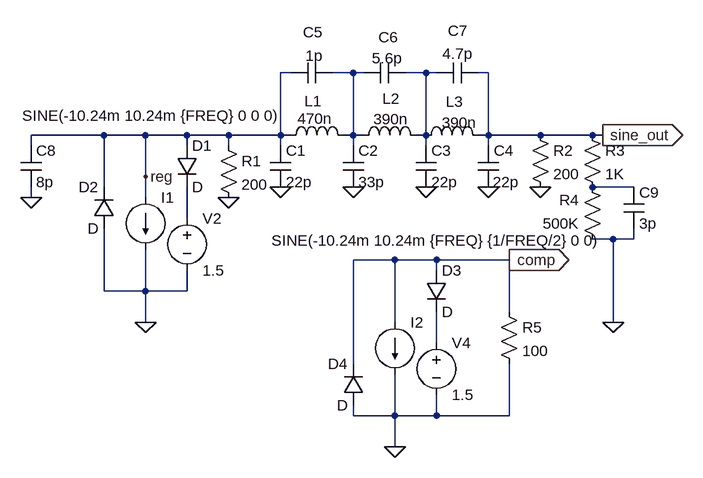
[diagram p0: schematic AD9850.asc]
AD9850.asc, the LTspice schematic file:
Version 4
SHEET 1 1172 680
WIRE 192 -16 176 -16
WIRE 288 -16 256 -16
WIRE 304 -16 288 -16
WIRE 400 -16 368 -16
WIRE 416 -16 400 -16
WIRE 496 -16 480 -16
WIRE -96 80 -208 80
WIRE -32 80 -96 80
WIRE 32 80 -32 80
WIRE 96 80 32 80
WIRE 176 80 176 -16
WIRE 176 80 96 80
WIRE 192 80 176 80
WIRE 288 80 288 -16
WIRE 288 80 272 80
WIRE 304 80 288 80
WIRE 400 80 400 -16
WIRE 400 80 384 80
WIRE 496 80 496 -16
WIRE 496 80 480 80
WIRE 576 80 496 80
WIRE 656 80 576 80
WIRE 672 80 656 80
WIRE -208 96 -208 80
WIRE 32 96 32 80
WIRE 96 96 96 80
WIRE 176 96 176 80
WIRE 288 96 288 80
WIRE 400 96 400 80
WIRE 496 96 496 80
WIRE -32 144 -32 80
WIRE -96 160 -96 80
WIRE 720 160 656 160
WIRE -208 176 -208 160
WIRE -32 176 -32 144
WIRE 32 208 32 160
WIRE 688 240 656 240
WIRE 720 240 720 224
WIRE 720 240 688 240
WIRE 352 272 288 272
WIRE 416 272 352 272
WIRE 528 272 416 272
WIRE 416 288 416 272
WIRE -96 320 -96 224
WIRE -32 320 -32 256
WIRE -32 320 -96 320
WIRE 32 320 32 288
WIRE 32 320 -32 320
WIRE 528 352 528 272
WIRE -32 368 -32 320
WIRE 352 368 352 272
WIRE 688 368 688 240
WIRE 416 400 416 352
WIRE 288 432 288 272
WIRE 288 512 288 496
WIRE 352 512 352 448
WIRE 352 512 288 512
WIRE 416 512 416 480
WIRE 416 512 352 512
WIRE 528 512 528 432
WIRE 528 512 416 512
WIRE 352 560 352 512
FLAG -32 368 0
FLAG 96 176 0
FLAG 176 160 0
FLAG 288 160 0
FLAG 400 160 0
FLAG 496 160 0
FLAG 576 160 0
FLAG 672 80 sine_out
IOPIN 672 80 Out
FLAG -208 176 0
FLAG 688 368 0
FLAG 352 560 0
FLAG 528 272 comp
IOPIN 528 272 Out
FLAG -32 144 reg
SYMBOL current -32 176 R0
WINDOW 3 -190 -126 Left 2
WINDOW 123 0 0 Left 0
WINDOW 39 24 28 Left 2
SYMATTR Value SINE(-10.24m 10.24m {FREQ} 0 0 0)
SYMATTR InstName I1
SYMBOL res 80 80 R0
SYMATTR InstName R1
SYMATTR Value 200
SYMBOL res 560 64 R0
SYMATTR InstName R2
SYMATTR Value 200
SYMBOL cap 160 96 R0
SYMATTR InstName C1
SYMATTR Value 22p
SYMBOL cap 272 96 R0
SYMATTR InstName C2
SYMATTR Value 33p
SYMBOL cap 384 96 R0
SYMATTR InstName C3
SYMATTR Value 22p
SYMBOL cap 480 96 R0
WINDOW 3 23 56 Left 2
SYMATTR Value 22p
SYMATTR InstName C4
SYMBOL ind 288 96 M270
WINDOW 0 53 62 VTop 2
WINDOW 3 57 59 VBottom 2
SYMATTR InstName L1
SYMATTR Value 470n
SYMBOL ind 400 96 M270
WINDOW 0 57 54 VTop 2
WINDOW 3 56 54 VBottom 2
SYMATTR InstName L2
SYMATTR Value 390n
SYMBOL ind 496 96 M270
WINDOW 0 52 52 VTop 2
WINDOW 3 51 45 VBottom 2
SYMATTR InstName L3
SYMATTR Value 390n
SYMBOL cap 256 -32 R90
WINDOW 0 -31 30 VBottom 2
WINDOW 3 -26 28 VTop 2
SYMATTR InstName C5
SYMATTR Value 1p
SYMBOL cap 368 -32 R90
WINDOW 0 -23 26 VBottom 2
WINDOW 3 -22 28 VTop 2
SYMATTR InstName C6
SYMATTR Value 5.6p
SYMBOL cap 480 -32 R90
WINDOW 0 -33 31 VBottom 2
WINDOW 3 -29 31 VTop 2
SYMATTR InstName C7
SYMATTR Value 4.7p
SYMBOL cap -224 96 R0
SYMATTR InstName C8
SYMATTR Value 8p
SYMBOL diode 16 96 R0
SYMATTR InstName D1
SYMBOL diode -80 224 R180
WINDOW 0 24 64 Left 2
WINDOW 3 24 0 Left 2
SYMATTR InstName D2
SYMBOL voltage 32 192 R0
WINDOW 123 0 0 Left 0
WINDOW 39 0 0 Left 0
SYMATTR InstName V2
SYMATTR Value 1.5
SYMBOL res 640 64 R0
SYMATTR InstName R3
SYMATTR Value 1K
SYMBOL res 672 256 R180
WINDOW 0 36 76 Left 2
WINDOW 3 36 40 Left 2
SYMATTR InstName R4
SYMATTR Value 500K
SYMBOL cap 704 160 R0
SYMATTR InstName C9
SYMATTR Value 3p
SYMBOL current 352 368 R0
WINDOW 3 -190 -126 Left 2
WINDOW 123 0 0 Left 0
WINDOW 39 24 28 Left 2
SYMATTR Value SINE(-10.24m 10.24m {FREQ} {1/FREQ/2} 0 0)
SYMATTR InstName I2
SYMBOL diode 400 288 R0
SYMATTR InstName D3
SYMBOL diode 304 496 R180
WINDOW 0 24 64 Left 2
WINDOW 3 24 0 Left 2
SYMATTR InstName D4
SYMBOL voltage 416 384 R0
WINDOW 123 0 0 Left 0
WINDOW 39 0 0 Left 0
SYMATTR InstName V4
SYMATTR Value 1.5
SYMBOL res 512 336 R0
SYMATTR InstName R5
SYMATTR Value 100

The netlist it stands for:
* AD9850.asc
I1 reg 0 SINE(-10.24m 10.24m {FREQ} 0 0 0)
R1 reg 0 200
R2 sine_out 0 200
C1 reg 0 22p
C2 N001 0 33p
C3 N002 0 22p
C4 sine_out 0 22p
L1 N001 reg 470n
L2 N002 N001 390n
L3 sine_out N002 390n
C5 N001 reg 1p
C6 N002 N001 5.6p
C7 sine_out N002 4.7p
C8 reg 0 8p
D1 reg N004 D
D2 0 reg D
V2 N004 0 1.5
R3 sine_out N003 1K
R4 0 N003 500K
C9 N003 0 3p
I2 comp 0 SINE(-10.24m 10.24m {FREQ} {1/FREQ/2} 0 0)
D3 comp N005 D
D4 0 comp D
V4 N005 0 1.5
R5 comp 0 100
.model D D
.lib standard.dio
.backanno
.end